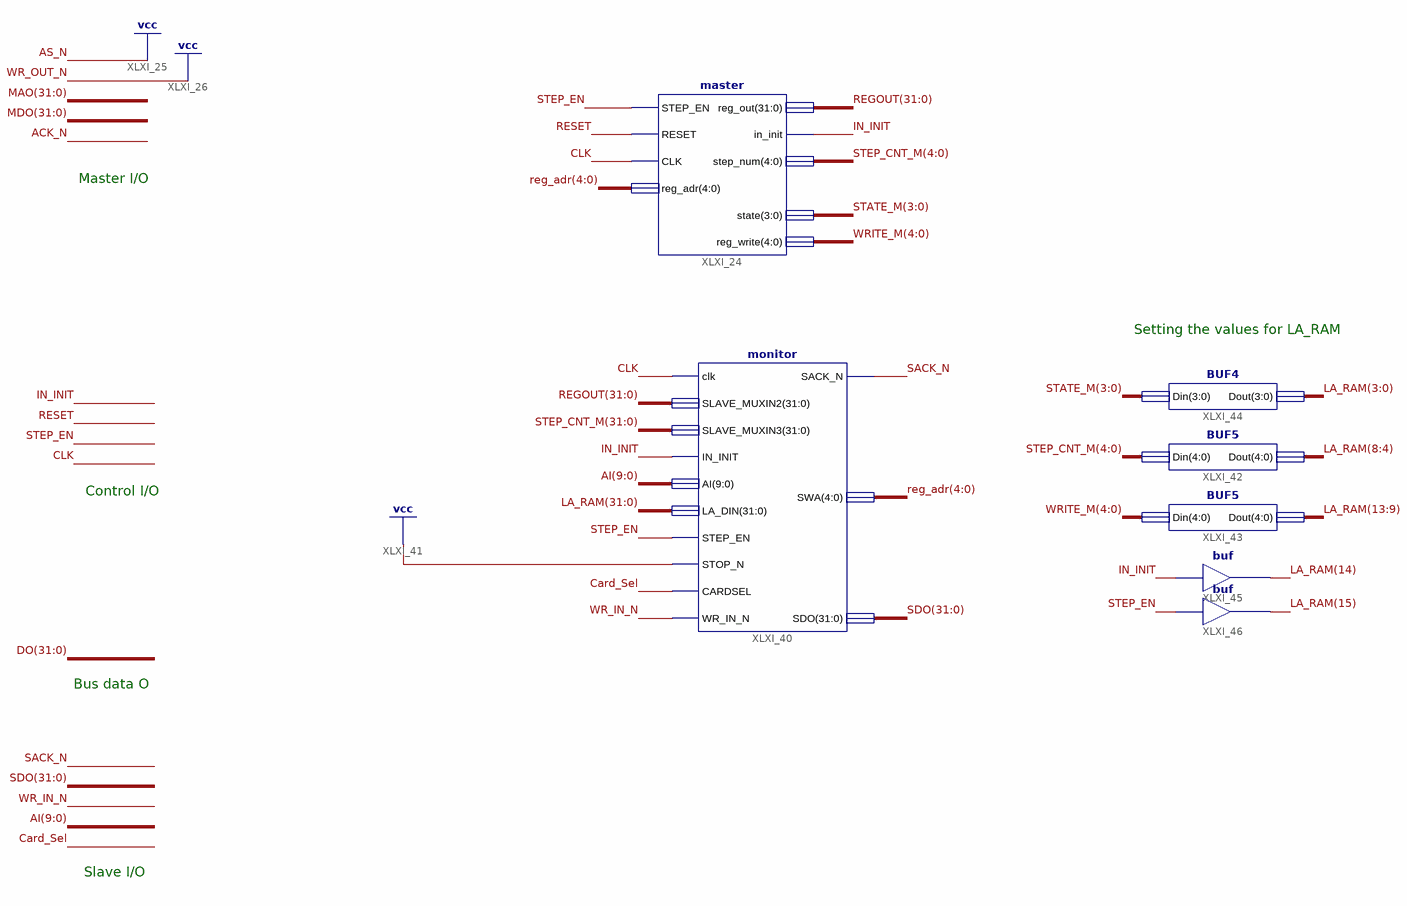
[diagram p0: schematic sheet 1]
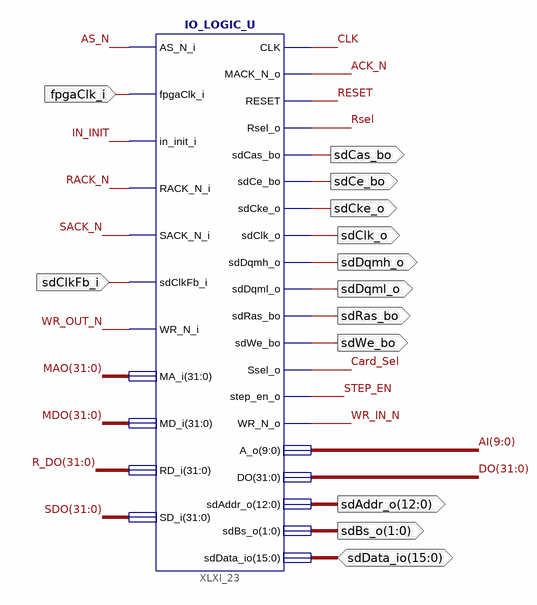
[diagram p1: schematic sheet 2]
// Xilinx ISE schematic Top_Level.sch (spartan6) as structural Verilog: 8 symbols, 13 ports
module Top_Level (
  input  fpgaClk_i,
  input  sdClkFb_i,
  inout  [15:0] sdData_io,
  output sdClk_o,
  output [1:0] sdBs_o,
  output sdDqml_o,
  output sdDqmh_o,
  output sdWe_bo,
  output sdCas_bo,
  output sdRas_bo,
  output sdCe_bo,
  output sdCke_o,
  output [12:0] sdAddr_o
);

  wire ACK_N, Card_Sel, CLK, IN_INIT, RACK_N, RESET, Rsel, SACK_N, STEP_EN, WR_IN_N;
  wire [3:0] STATE_M;
  wire [4:0] reg_adr, WRITE_M;
  wire [9:0] AI;
  wire [31:0] DO, LA_RAM, MAO, MDO, R_DO, REGOUT, SDO, STEP_CNT_M;

  IO_LOGIC_U XLXI_23 (
    .AS_N_i(1'b1), .fpgaClk_i(fpgaClk_i), .in_init_i(IN_INIT), .RACK_N_i(RACK_N), .SACK_N_i(SACK_N),
    .sdClkFb_i(sdClkFb_i), .WR_N_i(1'b1), .MA_i(MAO), .MD_i(MDO), .RD_i(R_DO), .SD_i(SDO), .CLK(CLK),
    .MACK_N_o(ACK_N), .RESET(RESET), .Rsel_o(Rsel), .sdCas_bo(sdCas_bo), .sdCe_bo(sdCe_bo),
    .sdCke_o(sdCke_o), .sdClk_o(sdClk_o), .sdDqmh_o(sdDqmh_o), .sdDqml_o(sdDqml_o), .sdRas_bo(sdRas_bo),
    .sdWe_bo(sdWe_bo), .Ssel_o(Card_Sel), .step_en_o(STEP_EN), .WR_N_o(WR_IN_N), .A_o(AI), .DO(DO),
    .sdAddr_o(sdAddr_o), .sdBs_o(sdBs_o), .sdData_io(sdData_io));
  master XLXI_24 (
    .STEP_EN(STEP_EN), .RESET(RESET), .CLK(CLK), .reg_adr(reg_adr), .reg_out(REGOUT), .in_init(IN_INIT),
    .step_num(STEP_CNT_M[4:0]), .state(STATE_M), .reg_write(WRITE_M));
  monitor XLXI_40 (
    .clk(CLK), .SLAVE_MUXIN2(REGOUT), .SLAVE_MUXIN3(STEP_CNT_M), .IN_INIT(IN_INIT), .AI(AI), .LA_DIN(LA_RAM),
    .STEP_EN(STEP_EN), .STOP_N(1'b1), .CARDSEL(Card_Sel), .WR_IN_N(WR_IN_N), .SACK_N(SACK_N), .SWA(reg_adr),
    .SDO(SDO));
  BUF5 XLXI_42 (.Din(STEP_CNT_M[4:0]), .Dout(LA_RAM[8:4]));
  BUF5 XLXI_43 (.Din(WRITE_M), .Dout(LA_RAM[13:9]));
  BUF4 XLXI_44 (.Din(STATE_M), .Dout(LA_RAM[3:0]));
  buf XLXI_45 (LA_RAM[14], IN_INIT);
  buf XLXI_46 (LA_RAM[15], STEP_EN);

  // Notes on the sheet:
  //   Master I/O
  //   Setting the values for LA_RAM
  //   Control I/O
  //   Bus data O
  //   Slave I/O
endmodule
